# Altium schematic sheet CPU.SchDoc
size A4; Address1: PXL EAI 1001; Revision: V 1.0; SheetNumber: 3; SheetTotal: 5; Sheet: 3 van 5
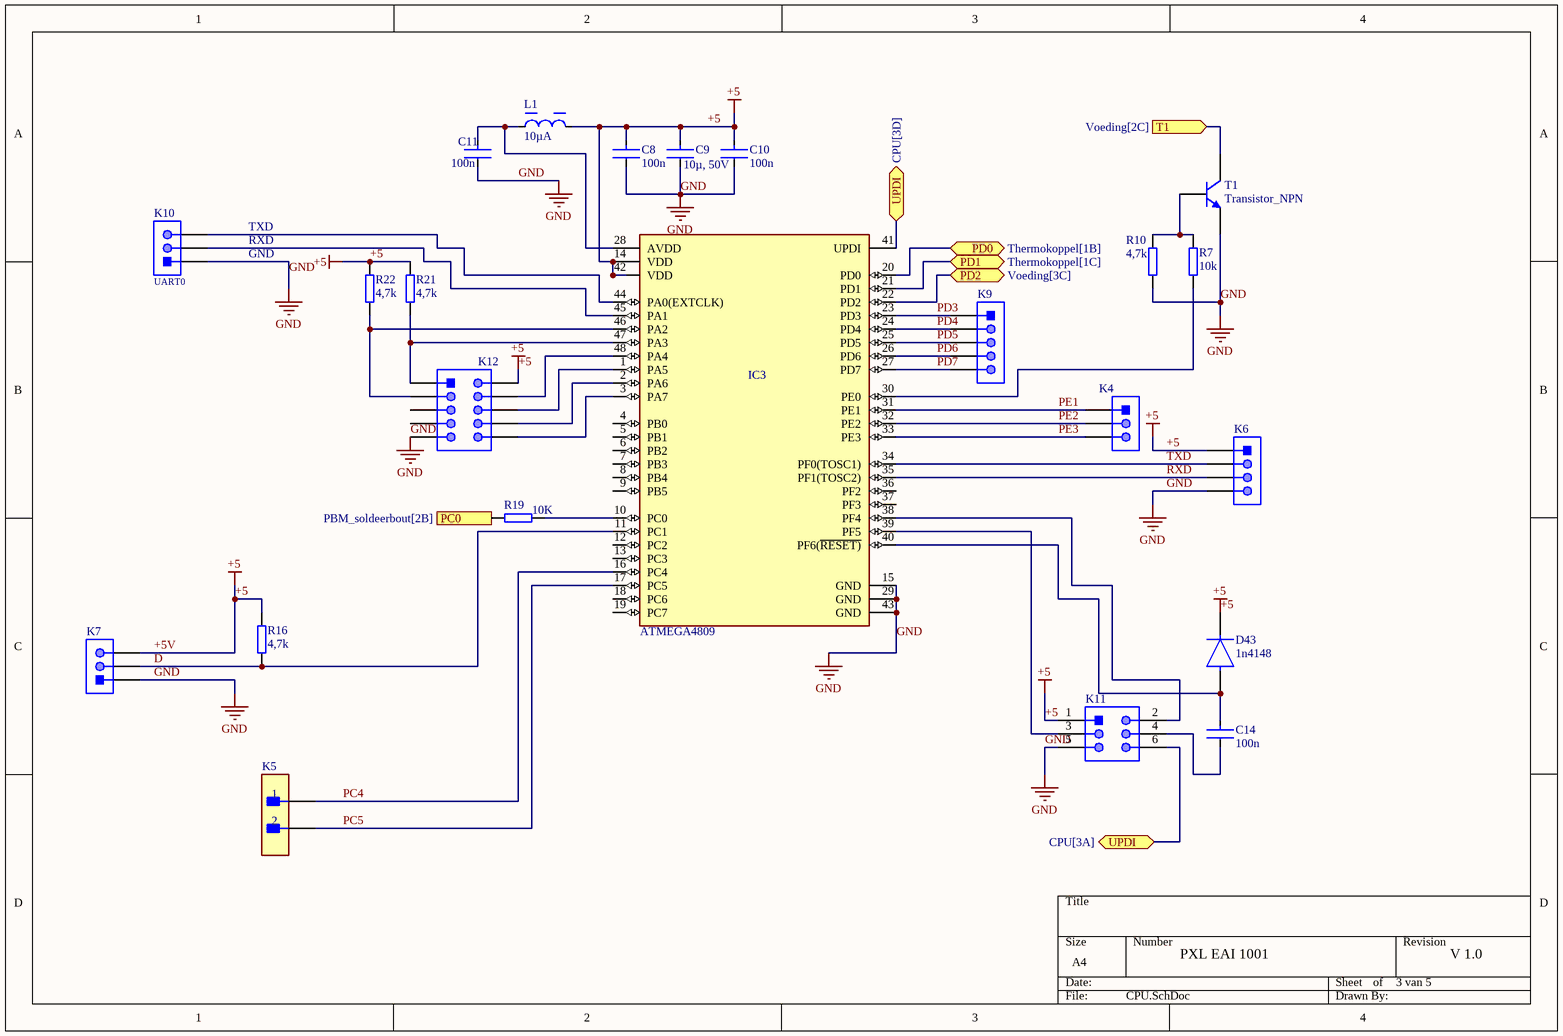
[diagram p0: CPU.SchDoc]

## Parts
C8  100n  [CC_0805_L]
C9  10µ, 50V  [CC_0805_L]
C10  100n  [CC_0805_L]
C11  100n  [CC_0805_L]
C14  100n  [CC_0805_L]
D43  1n4148  [SOD-123FL]
IC3  ATMEGA4809  [TQFP_48_M]
K4  61300311121  [pin header 1x3 - duplicate]  (value not drawn)
K5  M20-9990246  [pin header 1x2 - duplicate]  (value not drawn)
K6  61300411121  [pin header 1x4 - duplicate]  (value not drawn)
K7  61300311121  [pin header 1x3 - duplicate]  (value not drawn)
K9  61300511121  [pin header 1x5]  (value not drawn)
K10  UART0  [pin header 1x3 - duplicate]
K11  61300621121  [pin header 2x6]  (value not drawn)
K12  61201021621  [box header 10-pin]  (value not drawn)
L1  10µA  [CC_0805_L]
R7  10k  [R_0805_M]
R10  4,7k  [R_0805_M]
R16  4,7k  [R_0805_M]
R19  10K  [R_0805_M]
R21  4,7k  [R_0805_M]
R22  4,7k  [R_0805_M]
T1  Transistor_NPN  [SOT_23]

## Ports
PC0 (see PBM_soldeerbout[2B]), PD0 (bidir, see Thermokoppel[1B]), PD1 (bidir, see Thermokoppel[1C]), PD2 (bidir, see Voeding[3C]), T1 (in, see Voeding[2C]), UPDI (bidir, see CPU[3A]), UPDI (bidir, see CPU[3D])

## Nets
+5: C8.1 C9.1 C10.1 D43.1(C) IC3.14(VDD) IC3.42(VDD) K6.1 K7.3 K11.1 K12.2 L1.2 R16.2 R21.2 R22.2  [also labelled +5V]
GND: C8.2 C9.2 C10.2 C11.2 IC3.15(GND) IC3.29(GND) IC3.43(GND) K6.4 K7.1 K10.1 K11.5 K12.9 R10.1 T1.3(E)
D: IC3.11(PC1) K7.2 R16.1
PC0: R19.1 ; port PC0
PC4: IC3.16(PC4) K5.1
PC5: IC3.17(PC5) K5.2
PD0: IC3.20(PD0) ; port PD0
PD1: IC3.21(PD1) ; port PD1
PD2: IC3.22(PD2) ; port PD2
PD3: IC3.23(PD3) K9.1
PD4: IC3.24(PD4) K9.2
PD5: IC3.25(PD5) K9.3
PD6: IC3.26(PD6) K9.4
PD7: IC3.27(PD7) K9.5
PE1: IC3.31(PE1) K4.1
PE2: IC3.32(PE2) K4.2
PE3: IC3.33(PE3) K4.3
RXD: IC3.35(PF1(TOSC2)) K6.3
T1: T1.1(C) ; port T1
TXD: IC3.34(PF0(TOSC1)) K6.2
UPDI: IC3.41(UPDI) K11.6 ; port UPDI
NetC11_1: C11.1 IC3.28(AVDD) L1.1
NetC14_1: C14.1 D43.2(A) IC3.40(PF6(~{RESET)})
NetC14_2: C14.2 K11.4
NetIC3_1: IC3.1(PA5) K12.6
NetIC3_2: IC3.2(PA6) K12.8
NetIC3_3: IC3.3(PA7) K12.10
NetIC3_10: IC3.10(PC0) R19.2
NetIC3_30: IC3.30(PE0) R7.1
NetIC3_38: IC3.38(PF4) K11.2
NetIC3_39: IC3.39(PF5) K11.3
NetIC3_44: IC3.44(PA0(EXTCLK)) K10.3
NetIC3_45: IC3.45(PA1) K10.2
NetIC3_46: IC3.46(PA2) K12.3 R22.1
NetIC3_47: IC3.47(PA3) K12.1 R21.1
NetIC3_48: IC3.48(PA4) K12.4
NetR7_2: R7.2 R10.2 T1.2(B)

Not connected (* = marked no-connect by the designer): IC3 4(PB0) 5(PB1) 6(PB2) 7(PB3) 8(PB4) 9(PB5) 12(PC2) 13(PC3) 18(PC6) 19(PC7) 36(PF2) 37(PF3); K12 5 7

## Notes on the sheet
- TXD
- RXD
- GND

## Library data of the parts
C8 C10 C11 C14 = Capacitor_Ceramic: Manufacturer: KEMET; Manufacturer Part Number: C0805C224K5RACTU; Value: 0.22 μF; Temperature Characteristic: X7R; Temperature Coefficient: 30ppm/°C; Tolerance: 0.1; Voltage Rating: 50 V; ComponentLink2URL: https://content.kemet.com/datasheets/KEM_C1003_C0G_SMD.pdf; Device Class L3: Ceramic Capacitors; Lead Free: Yes; Temperature: -55°C to +125°C; RoHS: TRUE; Capacitance: 0.22 μF; Automotive: No; Material: Ceramic; Octopart: https://octopart.com/c0805c224k5ractu-kemet-144670; Temperature Range Low: -55°C; Height: 0.88mm; Device Class L1: Passive Components; Digikey Description: CAP CER 0.22UF 50V X7R 0805; ComponentLink2Description: Datasheet; Mouser Description: CAP CER 0.22UF 50V X7R 0805; Category: Cap; Ipc Land Pattern Name: CAPC200125X78; Temperature Range High: +125°C; Package: C0805C-DN; Device Class L2: Capacitors
C9 = Capacitor_Ceramic: Manufacturer: KEMET; Manufacturer Part Number: C0805C224K5RACTU; Value: 0.22 μF; Temperature Characteristic: X7R; Temperature Coefficient: 30ppm/°C; Tolerance: 0.1; ComponentLink2URL: https://content.kemet.com/datasheets/KEM_C1003_C0G_SMD.pdf; Device Class L3: Ceramic Capacitors; Lead Free: Yes; Temperature: -55°C to +125°C; RoHS: TRUE; Capacitance: 0.22 μF; Automotive: No; Material: Ceramic; Octopart: https://octopart.com/c0805c224k5ractu-kemet-144670; Temperature Range Low: -55°C; Height: 0.88mm; Device Class L1: Passive Components; Digikey Description: CAP CER 0.22UF 50V X7R 0805; ComponentLink2Description: Datasheet; Mouser Description: CAP CER 0.22UF 50V X7R 0805; Category: Cap; Ipc Land Pattern Name: CAPC200125X78; Temperature Range High: +125°C; Package: C0805C-DN; Device Class L2: Capacitors; Voltage Rating: 50 V
D43 = Diode: Manufacturer Part Number: 1N4007; Manufacturer: Diotec; Max Surge Forward Current: 27A; Forward Current: 1A; Max Junction Temp: +175°C; Reverse Voltage: 1000V; Value: 15pF; Peak Reverse Current: 5uA; Category: Diode; Temperature Range Low: -50°C; Automotive: No; Temperature: -50°C to +175°C; Lead Free: Yes; ComponentLink2Description: Datasheet; Max Repetitive Reverse Voltage: 1000V; ComponentLink2URL: https://datasheet.octopart.com/1N4007-Diotec-datasheet-62346875.pdf; Device Class L3: Rectifier Diodes; Height: 2.8mm; Octopart: https://octopart.com/1n4007-diotec-4040411; Package: 1N4007; Temperature Range High: +175°C; Device Class L1: Discrete Semiconductors; Device Class L2: Diodes; RoHS: TRUE; Capacitance: 15pF; Ipc Land Pattern Name: DIOAD888W100L520D280
IC3 = ATMEGA4809: Peripherals: Brown-out Detect/Reset; Number of I/Os: 41; Core Architecture: AVR; Memory Size: 48KB; Interface: I2C; Oscillator Type: Internal; Memory Type: FLASH; Series: megaAVR® 0, Functional Safety (FuSa); Min Operating Temperature: -40°C; Mount: Surface Mount; Case/Package: TQFP; RoHS Compliant: Yes; Max Operating Temperature: 85°C
K4 K7 = 1x3: THT Vertical Pin Header WR-PHD, Pitch 2.54 mm, Single Row, 3 pins; Manufacturer: Wurth Elektronik; Withstanding Voltage: 500VAC; Working Voltage: 250VAC; Rated Current: 3A; Pitch: 2.54mm; Pin Number: 3; Gender: Male; Contact Resistance: 20mOhm; Package Reference: 61300311121; Manufacturer URL: http://www.we-online.de; Datasheet URL: https://katalog.we-online.de/em/datasheet/6130xx11121.pdf; Operating Temperature: -40to105degC; Part Number: 61300311121; Orientation: Vertical; Packaging: Bag; Row Number: Single; Mounting Technology: THT; Publisher: WurthElektronik
K5 = 1x2: CONN HEADER VERT 2POS 2.54MM; Manufacturer: Harwin; Conn Gender: Male; Conn Orientation: Vertical; Number Of Contacts: 2; Current Rating: 3A; ComponentLink2URL: https://cdn.harwin.com/pdfs/M20-999.pdf; ComponentLink2Description: Datasheet; Package: M20-9990246; Temperature: -40°C to +105°C; Octopart: https://octopart.com/m20-9990246-harwin-2590635; Mouser Description: 2.54mm (0.1") Pitch SIL Vertical PC Tail Pin Header, 6.1mm mating pin height, tin, 2 contacts; Temperature Range High: +105°C; Device Class L1: Connectors; RoHS: TRUE; Automotive: No; Height: 8.99mm; Number Of Rows: 1; Contact Material: Tin,Nickel; Category: Conn; Pitch: 2.54mm; Lead Free: Yes; Digikey Description: CONN HEADER VERT 2POS 2.54MM; Manufacturer Part Number: M20-9990246; Temperature Range Low: -40°C; Device Class L3: unset; Device Class L2: Headers and Wire Housings
K6 = 1x4: THT Vertical Pin Header WR-PHD, Pitch 2.54 mm, Single Row, 4 pins; Manufacturer: Wurth Elektronik; Withstanding Voltage: 500VAC; Rated Current: 3A; Working Voltage: 250VAC; Pin Number: 4; Gender: Male; Contact Resistance: 20mOhm; Pitch: 2.54mm; Manufacturer URL: http://www.we-online.de; Operating Temperature: -40to105degC; Packaging: Bag; Mounting Technology: THT; Package Reference: 61300411121; Datasheet URL: https://katalog.we-online.de/em/datasheet/6130xx11121.pdf; Publisher: WurthElektronik; Part Number: 61300411121; Row Number: Single; Orientation: Vertical
K9 = 1x5: THT Vertical Pin Header WR-PHD, Pitch 2.54 mm, Single Row, 5 pins; Manufacturer: Wurth Elektronik; Pin Number: 5; Contact Resistance: 20mOhm; Working Voltage: 250VAC; Pitch: 2.54mm; Withstanding Voltage: 500VAC; Rated Current: 3A; Gender: Male; Datasheet URL: https://katalog.we-online.de/em/datasheet/6130xx11121.pdf; Orientation: Vertical; Mounting Technology: THT; Row Number: Single; Package Reference: 61300511121; Publisher: WurthElektronik; Part Number: 61300511121; Packaging: Bag; Manufacturer URL: http://www.we-online.de; Operating Temperature: -40to105degC
K10 = 1x3: THT Vertical Pin Header WR-PHD, Pitch 2.54 mm, Single Row, 3 pins; Part Number: 61300311121; Manufacturer: Wurth Elektronik; Withstanding Voltage: 500VAC; Working Voltage: 250VAC; Rated Current: 3A; Pitch: 2.54mm; Pin Number: 3; Gender: Male; Contact Resistance: 20mOhm; Package Reference: 61300311121; Manufacturer URL: http://www.we-online.de; Datasheet URL: https://katalog.we-online.de/em/datasheet/6130xx11121.pdf; Operating Temperature: -40to105degC; Orientation: Vertical; Packaging: Bag; Row Number: Single; Mounting Technology: THT; Publisher: WurthElektronik
K11 = 2x3: THT Vertical Pin Header WR-PHD, Pitch 2.54 mm, Dual Row, 6 pins; Manufacturer: Wurth Elektronik; Contact Resistance: 20mOhm; Withstanding Voltage: 500VAC; Pin Number: 6; Gender: Male; Pitch: 2.54mm; Working Voltage: 250VAC; Rated Current: 3A; Packaging: Bag; Row Number: Dual; Manufacturer URL: http://www.we-online.de; Part Number: 61300621121; Operating Temperature: -40to105degC; Mounting Technology: THT; Package Reference: 61300621121; Datasheet URL: https://katalog.we-online.de/em/datasheet/6130xx21121.pdf; Orientation: Vertical; Publisher: WurthElektronik
K12 = 5x2: Male Box Header WR-BHD, THT, Vertical, pitch 2.54 mm, 10 pins; Manufacturer: Wurth Elektronik; Contact Resistance: 20mOhm; Withstanding Voltage: 500VAC; Pin Number: 10; Working Voltage: 250VAC; Pitch: 2.54mm; Mounting Technology: THT; Operating Temperature: -40to125degC; Published Date: August2018; Gender: Male; Packaging: Tray; Manufacturer URL: http://www.we-online.de; Datasheet URL: https://katalog.we-online.de/em/datasheet/6120xx21621.pdf; Orientation: Vertical; Package Reference: 61201021621; Part Number: 61201021621; Publisher: WurthElektronik
L1 = Choke: Tolerance: 20%; Shielding: Shielded; Saturation Current: 10A; Test Frequency: 100kHz; RMS Current (Irms): 8.5A; Inductance: 10uH; Series Resistance: 14.1R; DC Resistance (DCR): 14.1mR; Self Resonant Frequency: 18MHz; Ratings: AEC-Q200; Width: 12.8mm; Series: WE-HCI; Length: 0.512inch; Mount: Surface Mount; Resistor Type: Wirewound; RoHS Compliant: Yes; Package Quantity: 1; Min Operating Temperature: -40°C; Inductance Tolerance: 20%; Termination: SMD/SMT; Max DC Current: 8.5A; Height - Seated (Max): 0.197inch; Case/Package: 1350; Current Rating: 8.5A; Max Operating Temperature: 155°C; Packaging: Tape and Reel; Height: 4.7mm
R7 R10 R16 R19 R21 R22 = Resistor: Manufacturer: Vishay Dale; Part Number: CRCW08050000Z0EA
T1 = Transistor_NPN: Manufacturer: On Semiconductor; PartNumber: BC547C; IC Continuous (A): 0.1; fT Min (MHz): 150; Packing: Bulk Box; Polarity: NPN; Mounting Technology: Through Hole; ComponentLink1URL: http://www.onsemi.com/; ComponentLink1Description: Manufacturer URL; ComponentLink3URL: http://www.onsemi.cn/pub_link/Collateral/2N6426-D.PDF; DatasheetVersion: Rev. 7; PackageVersion: Rev. AM; RoHS: FALSE; ComponentLink2URL: http://www.onsemi.com/pub_link/Collateral/BC546-D.PDF; ComponentLink3Description: Package Specification; PackageDescription: 3-Pin Transistor Outline, Body 4.825 x 3.685 mm, Pitch 1.27 mm; PackageReference: TO-92-3-29-11_AM_SL; ComponentLink2Description: Datasheet